# Altium schematic sheet CAN 3V3.SchDoc
size A
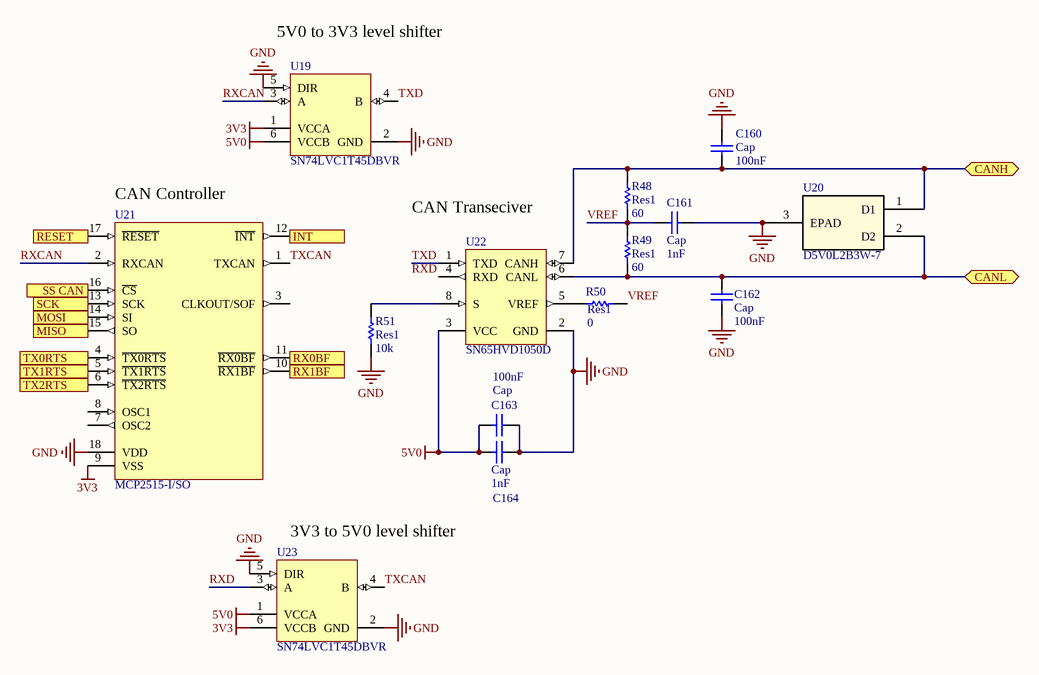
[diagram p0: CAN 3V3.SchDoc]

## Parts
C160  Cap  value 100nF  [1608[0603]]
C161  Cap  value 1nF  [1608[0603]]
C162  Cap  value 100nF  [1608[0603]]
C163  Cap  value 100nF  [1608[0603]]
C164  Cap  value 1nF  [1608[0603]]
R48  Res1  value 60  [1608[0603]]
R49  Res1  value 60  [1608[0603]]
R50  Res1  value 0  [1608[0603]]
R51  Res1  value 10k  [1608[0603]]
U19  SN74LVC1T45DBVR  [DBV0006A_L]
U20  D5V0L2B3W-7  [SOT-323_DIO]
U21  MCP2515-I/SO  [SOIC-SO18_L]
U22  SN65HVD1050D  [D0008A_N]
U23  SN74LVC1T45DBVR  [DBV0006A_L]

## Ports
CANH (bidir), CANL (bidir), INT (out), MISO (out), MOSI (in), RESET (in), RX0BF (out), RX1BF (out), SCK (in), SS CAN (in), TX0RTS (in), TX1RTS (in), TX2RTS (in)

## Nets
3V3: U19.1(VCCA) U21.9(VSS) U23.6(VCCB)
5V0: C163.1 C164.2 U19.6(VCCB) U22.3(VCC) U23.1(VCCA)
GND: C160.1 C161.2 C162.1 C163.2 C164.1 R51.1 U19.2(GND) U19.5(DIR) U20.3(EPAD) U21.18(VDD) U22.2(GND) U23.2(GND) U23.5(DIR)
CANH: C160.2 R48.1 U20.1(D1) U22.7(CANH) ; port CANH
CANL: C162.2 R49.1 U20.2(D2) U22.6(CANL) ; port CANL
INT: U21.12(~{INT}) ; port INT
MISO: U21.15(SO) ; port MISO
MOSI: U21.14(SI) ; port MOSI
RESET: U21.17(~{RESET}) ; port RESET
RX0BF: U21.11(~{RX0BF}) ; port RX0BF
RX1BF: U21.10(~{RX1BF}) ; port RX1BF
RXCAN: U19.3(A) U21.2(RXCAN)
RXD: U23.3(A)
SCK: U21.13(SCK) ; port SCK
SS CAN: U21.16(~{CS}) ; port SS CAN
TX0RTS: U21.4(~{TX0RTS}) ; port TX0RTS
TX1RTS: U21.5(~{TX1RTS}) ; port TX1RTS
TX2RTS: U21.6(~{TX2RTS}) ; port TX2RTS
TXCAN: U21.1(TXCAN) U23.4(B)
TXD: U19.4(B) U22.1(TXD)
VREF: C161.1 R48.2 R49.2 R50.2
NetR50_1: R50.1 U22.5(VREF)
NetR51_2: R51.2 U22.8(S)

Not connected (* = marked no-connect by the designer): U21 3(CLKOUT/SOF) 7(OSC2) 8(OSC1); U22 4(RXD)

## Notes on the sheet
- (near U19) 5V0 to 3V3 level shifter
- (near U21) CAN Controller
- (near U22) CAN Transeciver
- (near U23) 3V3 to 5V0 level shifter
- Labels drawn without touching a wire or pin: RXD

## Library data of the parts
C160-C164 = Cap: Capacitor; Published: 8-Jun-2000; LatestRevisionDate: 17-Jul-2002; LatestRevisionNote: Re-released for DXP Platform.; PackageReference: RAD-0.3; Publisher: Altium Limited; PackageDescription: Radial Cap, Thru-Hole; 2 Leads; 0.3 in Pin Spacing
R48-R51 = Res1: Resistor; Published: 8-Jun-2000; LatestRevisionDate: 17-Jul-2002; LatestRevisionNote: Re-released for DXP Platform.; PackageReference: AXIAL-0.3; Publisher: Altium Limited; PackageDescription: Axial Device, Thru-Hole; 2 Leads; 0.3 in Pin Spacing
U19 U23 = CMP-0859-00206-3: Single-Bit Dual-Supply Bus Transceiver with Configurable Voltage Translation and 3-State Outputs, DBV0006A, LARGE T&R; Manufacturer: Texas Instruments; VCC(Max)(V): 5.5; Input Type: CMOS/TTL; Technology Family: LVC; Voltage(Nom)(V): 1.8,2.5,3.3,5; ICC @ Nom Voltage(Max)(mA): 0.004; Bits(#): 1; F @ Nom Voltage(Max)(Mhz): 150; Output Drive (IOL/IOH)(Max)(mA): 32/-32; 3-State Output: Yes; Logic: True; Schmitt Trigger: No; Output Type: CMOS; Rating: Catalog; tpd @ Nom Voltage(Max)(ns): 15.5,8,5.8,4.4; VCC(Min)(V): 1.65; Sub-Family: Dual Supply Translator; Generic Part Number: SN74LVC1T45; PackageReference: DBV0006A; DatasheetVersion: SCES515K; Operating Temperature Range(C): -40 to 85
U20 = D5V0L2B3W-7: No Description Available; Vendor: Diodes Inc; Built_By: EMA_UL_Team; SourceLibrary: DIODESINC_2_2015-08-18; Manufacturer_Part_Number: D5V0L2B3W-7; Copyright: Copyright (C) 2018 Accelerated Designs. All rights reserved; RefDes: RefDes; Type: DEV
U21 = CMP-0186-00133-2: Stand-Alone CAN Controller With SPI Interface, 18-Pin SOIC, Industrial Temperature; ComponentLink2Description: Datasheet; RevisionNote: URLs added. DatasheetVersion updated.; PackageVersion: revBB, Aug-2009; ComponentLink1URL: http://www.microchip.com/; PackageReference: SOIC-SO18; PackageDescription: 18-Lead Plastic Small Outline (SO) - Wide 7.50mm Body [SOIC]; DatasheetVersion: revF, Oct-2010; ComponentLink2URL: http://ww1.microchip.com/downloads/en/DeviceDoc/21801f.pdf; ComponentLink3URL: http://www.microchip.com/stellent/groups/techpub_sg/documents/packagingspec/en012702.pdf; Code_JEDEC: MS-013; ComponentLink3Description: Package Specification; ComponentLink1Description: Manufacturer URL
U22 = CMP-0315-00048-2: High-Speed EMC Optimized CAN Transceiver, 70 mA, 5 V, -40 to 125 degC, 8-pin SOIC (D), Green (RoHS & no Sb/Br); Manufacturer: Texas Instruments; Bus Fault Voltage(V): -4 to 16; Rating: Catalog; Drivers Per Package: 1; Transient Pulse Protection(V): -200 to 200; ICC(Max)(mA): 70; Supply Voltage(s)(V): 5; PackageVersion: revM, Jun-2011; PartNumber: SN65HVD1050D; PackageReference: D0008A; Code_JEDEC: MS-012AA; Isolated: No; ComponentLink1Description: Datasheet; PackageDescription: 8-Pin Plastic Small Outline Integrated Circuit, 4.9 x 3.9 mm, Pitch 1.27 mm Pitch; Receivers Per Package: 1; Footprint: TJA1050; DatasheetVersion: SLLS632B; SubFamily: CAN; ComponentLink1URL: http://www.ti.com/general/docs/lit/getliterature.tsp?genericPartNumber=SN65HVD1050&fileType=pdf; Eco-Plan: Green (RoHS & no Sb/Br); Mounting Technology: Surface Mount